# EAGLE design dot-reader (EAGLE 7.7.0)
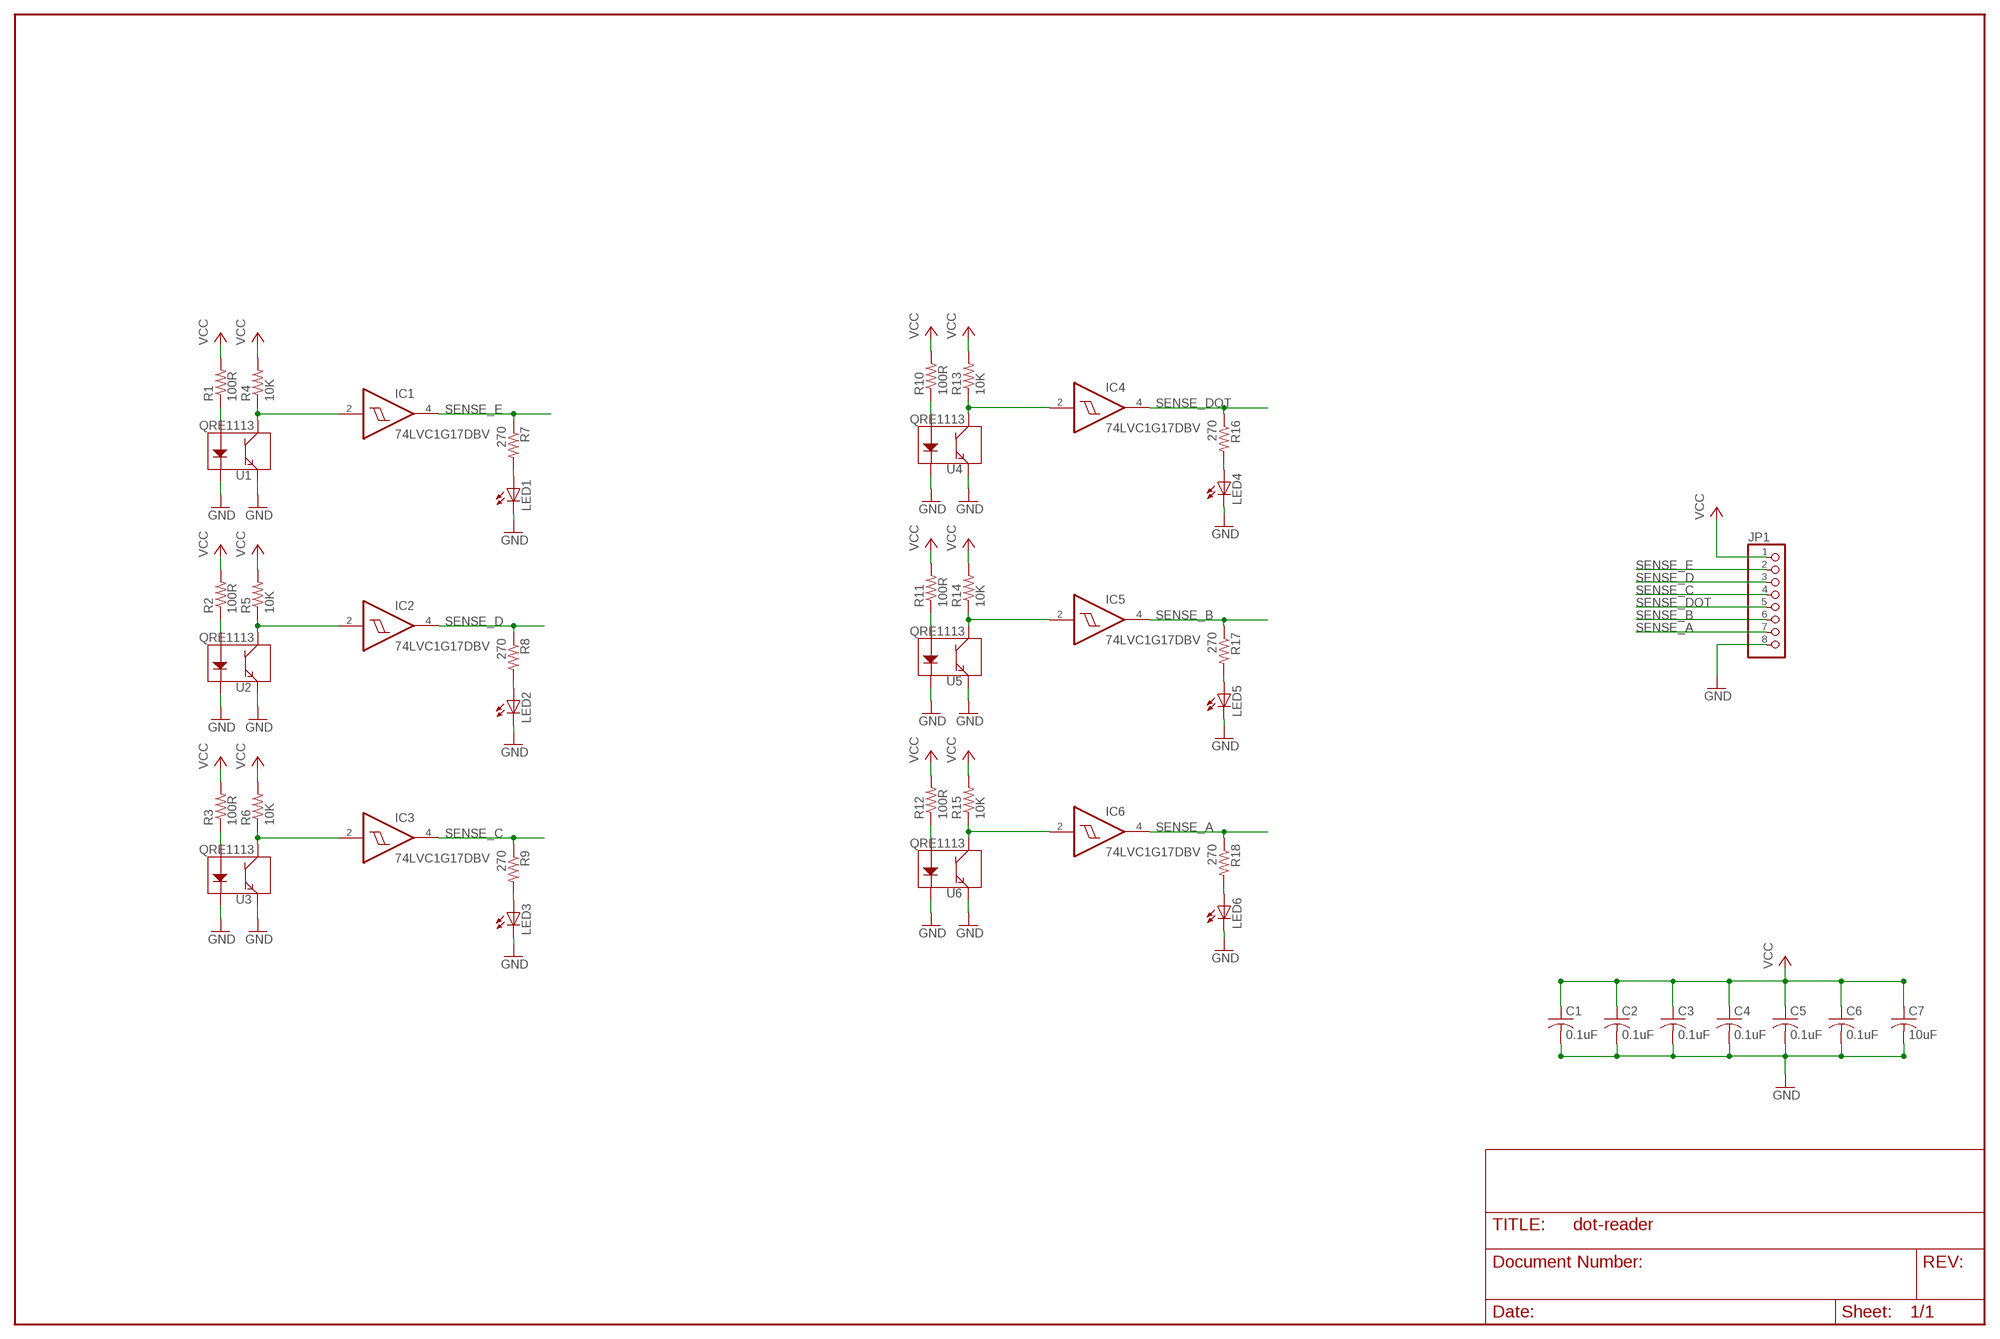
[diagram p0: schematic, sheet 1]

## Parts
C1  0.1uF  C-USC0603  [C0603]
C2  0.1uF  C-USC0603  [C0603]
C3  0.1uF  C-USC0603  [C0603]
C4  0.1uF  C-USC0603  [C0603]
C5  0.1uF  C-USC0603  [C0603]
C6  0.1uF  C-USC0603  [C0603]
C7  10uF  C-USC0805  [C0805]
IC1  74LVC1G17DBV  [SOT23-5]
IC2  74LVC1G17DBV  [SOT23-5]
IC3  74LVC1G17DBV  [SOT23-5]
IC4  74LVC1G17DBV  [SOT23-5]
IC5  74LVC1G17DBV  [SOT23-5]
IC6  74LVC1G17DBV  [SOT23-5]
JP1  PINHD-1X8  [1X08]
LED1  LEDCHIP-LED0805  [CHIP-LED0805]
LED2  LEDCHIP-LED0805  [CHIP-LED0805]
LED3  LEDCHIP-LED0805  [CHIP-LED0805]
LED4  LEDCHIP-LED0805  [CHIP-LED0805]
LED5  LEDCHIP-LED0805  [CHIP-LED0805]
LED6  LEDCHIP-LED0805  [CHIP-LED0805]
R1  100R  R-US_M0805  [M0805]
R2  100R  R-US_M0805  [M0805]
R3  100R  R-US_M0805  [M0805]
R4  10K  R-US_M0805  [M0805]
R5  10K  R-US_M0805  [M0805]
R6  10K  R-US_M0805  [M0805]
R7  270  R-US_R0805  [R0805]
R8  270  R-US_R0805  [R0805]
R9  270  R-US_R0805  [R0805]
R10  100R  R-US_M0805  [M0805]
R11  100R  R-US_M0805  [M0805]
R12  100R  R-US_M0805  [M0805]
R13  10K  R-US_M0805  [M0805]
R14  10K  R-US_M0805  [M0805]
R15  10K  R-US_M0805  [M0805]
R16  270  R-US_R0805  [R0805]
R17  270  R-US_R0805  [R0805]
R18  270  R-US_R0805  [R0805]
U1  QRE1113  [QRE1113]
U2  QRE1113  [QRE1113]
U3  QRE1113  [QRE1113]
U4  QRE1113  [QRE1113]
U5  QRE1113  [QRE1113]
U6  QRE1113  [QRE1113]

## Nets
A: IC1.2(I) R4.1 U1.3(C)
B: IC2.2(I) R5.1 U2.3(C)
C: IC4.2(I) R13.1 U4.3(C)
D: IC5.2(I) R14.1 U5.3(C)
DOT: IC3.2(I) R6.1 U3.3(C)
E: IC6.2(I) R15.1 U6.3(C)
GND: C1.2 C2.2 C3.2 C4.2 C5.2 C6.2 C7.2 JP1.8 LED1.C LED2.C LED3.C LED4.C LED5.C LED6.C U1.2(K) U1.4(E) U2.2(K) U2.4(E) U3.2(K) U3.4(E) U4.2(K) U4.4(E) U5.2(K) U5.4(E) U6.2(K) U6.4(E)
N$1: R1.1 U1.1(A)
N$2: LED2.A R8.2
N$3: R2.1 U2.1(A)
N$4: LED4.A R16.2
N$5: R3.1 U3.1(A)
N$6: LED5.A R17.2
N$7: R10.1 U4.1(A)
N$8: LED3.A R9.2
N$9: R11.1 U5.1(A)
N$10: LED6.A R18.2
N$11: R12.1 U6.1(A)
N$20: LED1.A R7.2
SENSE_A: IC6.4(O) JP1.7 R18.1
SENSE_B: IC5.4(O) JP1.6 R17.1
SENSE_C: IC3.4(O) JP1.4 R9.1
SENSE_D: IC2.4(O) JP1.3 R8.1
SENSE_DOT: IC4.4(O) JP1.5 R16.1
SENSE_E: IC1.4(O) JP1.2 R7.1
VCC: C1.1 C2.1 C3.1 C4.1 C5.1 C6.1 C7.1 JP1.1 R1.2 R2.2 R3.2 R4.2 R5.2 R6.2 R10.2 R11.2 R12.2 R13.2 R14.2 R15.2

## Power pins joined to a net without a drawn wire
GND: IC1.3(GND) IC2.3(GND) IC3.3(GND) IC4.3(GND) IC5.3(GND) IC6.3(GND)
VCC: IC1.5(VCC) IC2.5(VCC) IC3.5(VCC) IC4.5(VCC) IC5.5(VCC) IC6.5(VCC)

## Library data of the parts
C1-C7 = resistor:C-US: CAPACITOR, American symbol
IC1-IC6 = 74xx-little-us:74*1G17: Single Schmitt-Trigger Buffer
JP1 = custom-pinhead:PINHD-1X8: PIN HEADER
LED1-LED6 = led:LED: LED OSRAM: - CHIPLED LG R971, LG N971, LY N971, LG Q971, LY Q971, LO R971, LY R971 LH N974, LH R974 LS Q976, LO Q976, LY Q976 LO Q996 - Hyper CHIPLED LW Q18S LB Q993, LB Q99A, LB R99A - SideLED LS A670, LO A670, LY A670, LG A670, LP A670 LB A673, LV A673, LT A673, LW A673 LH A674 LY A675 LS A676, LA A676, LO A676, LY A676, LW A676 LS A679, LY A679, LG A679 - Hyper Micro SIDELED® LS Y876, LA Y876, LO Y876, LY Y876 LT Y87S - SmartLED LW L88C, LW L88S LB L89C, LB L89S, LG L890 LS L89K, LO L89K, LY L89K LS L896, LA L896, LO L896, LY L896 - TOPLED LS T670, LO T670, LY T670, LG T670, LP T670 LSG T670, LSP T670, LSY T670, LOP T670, LYG T670 LG T671, LOG T671, LSG T671 LB T673, LV T673, LT T673, LW T673 LH T674 LS T676, LA T676, LO T676, LY T676, LB T676, LH T676, LSB T676, LW T676 LB T67C, LV T67C, LT T67C, LS T67K, LO T67K, LY T67K, LW E67C LS E67B, LA E67B, LO E67B, LY E67B, LB E67C, LV E67C, LT E67C LW T67C LS T679, LY T679, LG T679 LS T770, LO T770, LY T770, LG T770, LP T770 LB T773, LV T773, LT T773, LW T773 LH T774 LS E675, LA E675, LY E675, LS T675 LS T776, LA T776, LO T776, LY T776, LB T776 LHGB T686 LT T68C, LB T68C - Hyper Mini TOPLED® LB M676 - Mini TOPLED Santana® LG M470 LS M47K, LO M47K, LY M47K Source: http://www.osram.convergy.de LUXEON: - LUMILED® LXK2-PW12-R00, LXK2-PW12-S00, LXK2-PW14-U00, LXK2-PW14-V00 LXK2-PM12-R00, LXK2-PM12-S00, LXK2-PM14-U00 LXK2-PE12-Q00, LXK2-PE12-R00, LXK2-PE12-S00, LXK2-PE14-T00, LXK2-PE14-U00 LXK2-PB12-K00, LXK2-PB12-L00, LXK2-PB12-M00, LXK2-PB14-N00, LXK2-PB14-P00, LXK2-PB14-Q00 LXK2-PR12-L00, LXK2-PR12-M00, LXK2-PR14-Q00, LXK2-PR14-R00 LXK2-PD12-Q00, LXK2-PD12-R00, LXK2-PD12-S00 LXK2-PH12-R00, LXK2-PH12-S00 LXK2-PL12-P00, LXK2-PL12-Q00, LXK2-PL12-R00 Source: www.luxeon.com KINGBRIGHT: KA-3528ASYC Source: www.kingbright.com
R1-R18 = resistor:R-US_: RESISTOR, American symbol
U1-U6 = SparkFun-Sensors:QRE1113: Reflective object sensor; PROD_ID: IC-09357

## Board
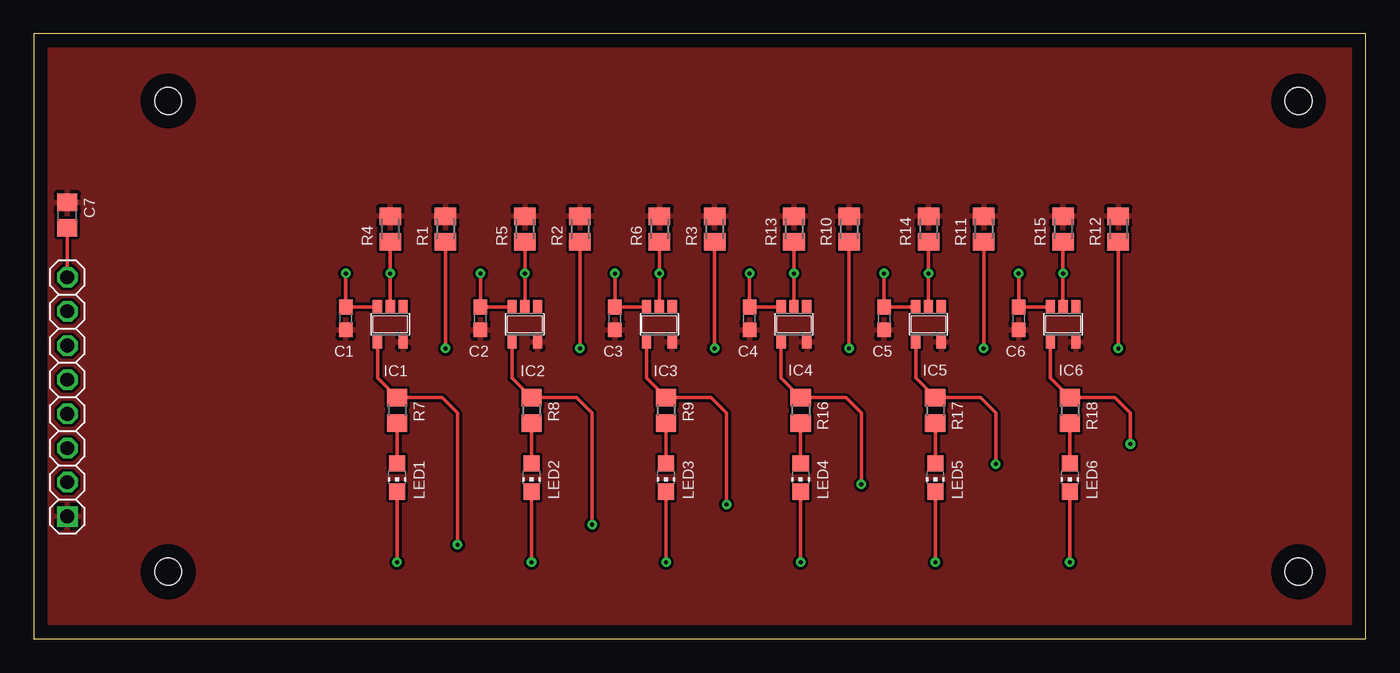
[diagram p1: board, top side]
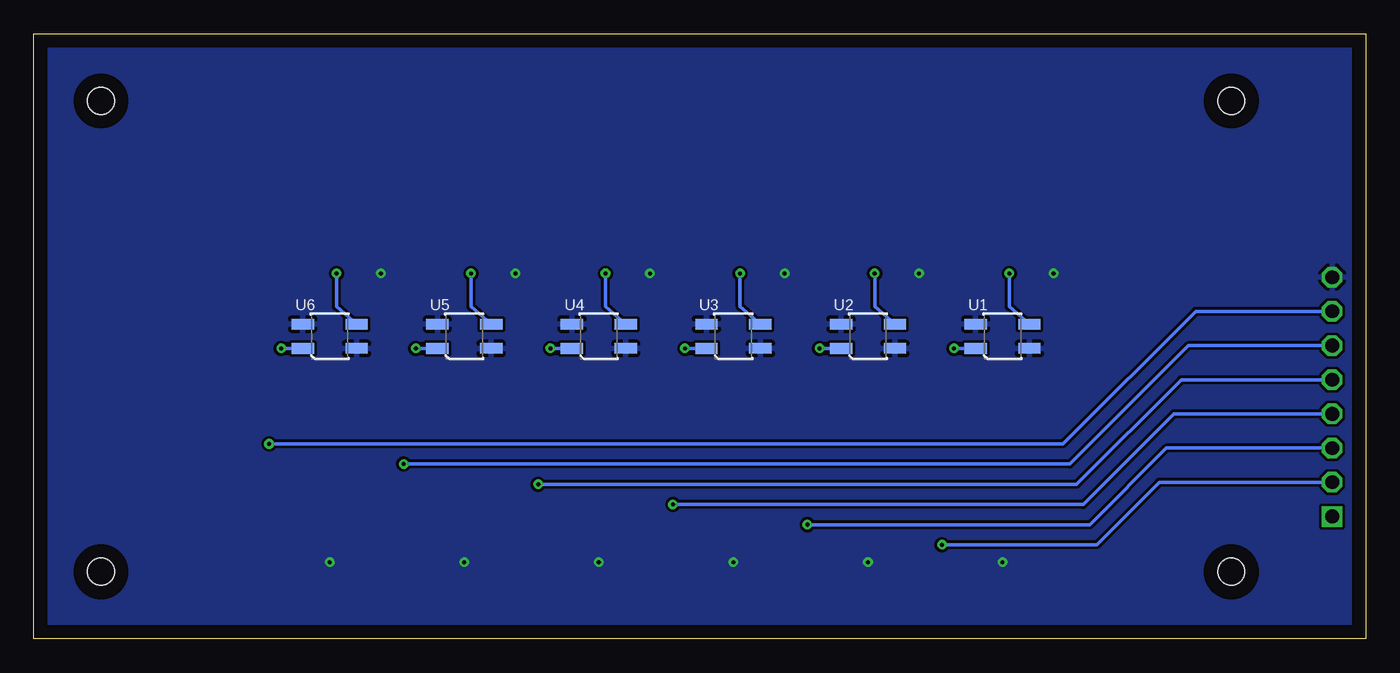
[diagram p2: board, bottom side, seen from below]

Size 99 x 45 mm. Coordinates in mm from the lower left corner, seen from the top.
Outline: 0,0 99,0 99,45 0,45 0,0
Copper layers (1*16): Top 0.035mm / dielectric 1.5mm / Bottom 0.035mm
Design rules "default": minimum track width 10mil, minimum drill 24mil, track to track 8mil, track to pad 8mil, pad to pad 8mil, via to via 8mil, smd to smd 8mil, copper to edge 40mil, drill to drill 8mil, minimum pad ring 10mil, minimum via ring 8mil, stop-mask expansion 4mil, vias tented up to drill 0mil, thermal gap 10mil
Holes 2.01 mm at 10,5 94,5 10,40 94,40
tRestrict: area 8,38 to 12,42; area 8,3 to 12,7; area 92,38 to 96,42; area 92,3 to 96,7
bRestrict: area 8,38 to 12,42; area 8,3 to 12,7; area 92,38 to 96,42; area 92,3 to 96,7

### Footprints (pad centres in the part's own frame; a part is rotated, then mirrored left to right if it is on the bottom)
C0603 = smd 1.1 x 1: 1 -0.85,0; 2 0.85,0
C0805 = smd 1.3 x 1.5: 1 -0.95,0; 2 0.95,0
SOT23-5 = smd 0.69 x 0.99: 1 -0.95,-1.29; 2 0,-1.29; 3 0.95,-1.29; 4 0.95,1.3; 5 -0.95,1.3
1X08 = drill 1.016 square: 1 -8.89,0 | drill 1.016 octagon: 2 -6.35,0; 3 -3.81,0; 4 -1.27,0; 5 1.27,0; 6 3.81,0; 7 6.35,0; 8 8.89,0
CHIP-LED0805 = smd 1.2 x 1.2: A 0,-1.05; C 0,1.05
M0805 = smd 1.3 x 1.6: 1 -0.95,0; 2 0.95,0
R0805 = smd 1.3 x 1.5: 1 -0.95,0; 2 0.95,0
QRE1113 = smd 1.66 x 0.79: 1 -2,-0.905; 2 2,-0.9; 3 2,0.9; 4 -2,0.905

### Placement (x,y rotation side)
C1  23.2,23.83 90 top
C2  33.2,23.83 90 top
C3  43.2,23.83 90 top
C4  53.2,23.83 90 top
C5  63.2,23.83 90 top
C6  73.2,23.83 90 top
C7  2.5,31.5 270 top
IC1  26.5,23.39 180 top
IC2  36.5,23.39 180 top
IC3  46.5,23.39 180 top
IC4  56.5,23.39 180 top
IC5  66.5,23.39 180 top
IC6  76.5,23.39 180 top
JP1  2.5,18 90 top
LED1  27,12 180 top
LED2  37,12 180 top
LED3  47,12 180 top
LED4  57,12 180 top
LED5  67,12 180 top
LED6  77,12 180 top
R1  30.6,30.48 90 top
R2  40.6,30.48 90 top
R3  50.6,30.48 90 top
R4  26.5,30.48 90 top
R5  36.5,30.48 90 top
R6  46.5,30.48 90 top
R7  27,17 270 top
R8  37,17 270 top
R9  47,17 270 top
R10  60.6,30.48 90 top
R11  70.6,30.48 90 top
R12  80.6,30.48 90 top
R13  56.5,30.48 90 top
R14  66.5,30.48 90 top
R15  76.5,30.48 90 top
R16  57,17 270 top
R17  67,17 270 top
R18  77,17 270 top
U1  27,22.5 0 bottom
U2  37,22.5 0 bottom
U3  47,22.5 0 bottom
U4  57,22.5 0 bottom
U5  67,22.5 0 bottom
U6  77,22.5 0 bottom

### Tracks (layer width: path | path; a pad name or v marks a point on that pad's centre or on a via)
A  (via drill 0.3)
  Top 0.254: IC1.2 v26.5,27.18 R4.1
  Bottom 0.254: U1.3 26.5,24.7 v26.5,27.18
B  (via drill 0.3)
  Top 0.254: IC2.2 v36.5,27.18 R5.1
  Bottom 0.254: U2.3 36.5,24.7 v36.5,27.18
C  (via drill 0.3)
  Top 0.254: IC4.2 v56.5,27.18 R13.1
  Bottom 0.254: U4.3 56.5,24.7 v56.5,27.18
D  (via drill 0.3)
  Top 0.254: IC5.2 v66.5,27.18 R14.1
  Bottom 0.254: U5.3 66.5,24.7 v66.5,27.18
DOT  (via drill 0.3)
  Top 0.254: IC3.2 v46.5,27.18 R6.1
  Bottom 0.254: U3.3 46.5,24.7 v46.5,27.18
E  (via drill 0.3)
  Top 0.254: IC6.2 v76.5,27.18 R15.1
  Bottom 0.254: U6.3 76.5,24.7 v76.5,27.18
GND  (via drill 0.3)
  Top 0.254: IC2.3 C2.2 v33.2,27.18 | v43.2,27.18 C3.2 IC3.3 | IC4.3 C4.2 v53.2,27.18 | IC5.3 C5.2 v63.2,27.18 | IC6.3 C6.2 v73.2,27.18 | IC1.3 C1.2 v23.2,27.18 | LED1.C v27,5.7 | LED2.C v37,5.7 | LED3.C v47,5.7 | LED4.C v57,5.7 | LED5.C v67,5.7 | LED6.C v77,5.7 | JP1.8 C7.2
  pour Bottom: 0,0 99,0 99,45 0,45
N$1  (via drill 0.3)
  Top 0.254: v30.6,21.6 R1.1
  Bottom 0.254: U1.1 v30.6,21.6
N$2
  Top 0.254: R8.2 LED2.A
N$3  (via drill 0.3)
  Top 0.254: v40.6,21.6 R2.1
  Bottom 0.254: U2.1 v40.6,21.6
N$4
  Top 0.254: R16.2 LED4.A
N$5  (via drill 0.3)
  Top 0.254: v50.6,21.6 R3.1
  Bottom 0.254: U3.1 v50.6,21.6
N$6
  Top 0.254: R17.2 LED5.A
N$7  (via drill 0.3)
  Top 0.254: v60.6,21.6 R10.1
  Bottom 0.254: U4.1 v60.6,21.6
N$8
  Top 0.254: R9.2 LED3.A
N$9  (via drill 0.3)
  Top 0.254: v70.6,21.6 R11.1
  Bottom 0.254: U5.1 v70.6,21.6
N$10
  Top 0.254: R18.2 LED6.A
N$11  (via drill 0.3)
  Top 0.254: v80.6,21.6 R12.1
  Bottom 0.254: U6.1 v80.6,21.6
N$20
  Top 0.254: R7.2 LED1.A
SENSE_A  (via drill 0.3)
  Top 0.254: IC6.4 75.55,19.4 R18.1 80.34,17.95 81.5,16.79 v81.5,14.5
  Bottom 0.254: v81.5,14.5 22.5,14.5 12.65,24.35 JP1.7
SENSE_B  (via drill 0.3)
  Top 0.254: IC5.4 65.55,19.4 R17.1 70.35,17.95 71.5,16.8 v71.5,13
  Bottom 0.254: v71.5,13 22,13 13.19,21.81 JP1.6
SENSE_C  (via drill 0.3)
  Top 0.254: IC3.4 45.55,19.4 R9.1 50.35,17.95 51.5,16.8 v51.5,10
  Bottom 0.254: v51.5,10 21,10 14.27,16.73 JP1.4
SENSE_D  (via drill 0.3)
  Top 0.254: IC2.4 35.55,19.4 R8.1 40.35,17.95 41.5,16.8 v41.5,8.5
  Bottom 0.254: v41.5,8.5 20.5,8.5 14.81,14.19 JP1.3
SENSE_DOT  (via drill 0.3)
  Top 0.254: IC4.4 55.55,19.4 R16.1 60.35,17.95 61.5,16.8 v61.5,11.5
  Bottom 0.254: v61.5,11.5 21.5,11.5 13.73,19.27 JP1.5
SENSE_E  (via drill 0.3)
  Top 0.254: IC1.4 25.55,19.4 R7.1 | R7.1 | R7.1 30.35,17.95 31.5,16.8 v31.5,7
  Bottom 0.254: v31.5,7 20,7 15.35,11.65 JP1.2
VCC
  pour Top: 0,0 99,0 99,45 0,45

### Text on the board
Document: E | D | C | VAL | B | A